# Altium project Pneumatics Control Board.PrjPcb
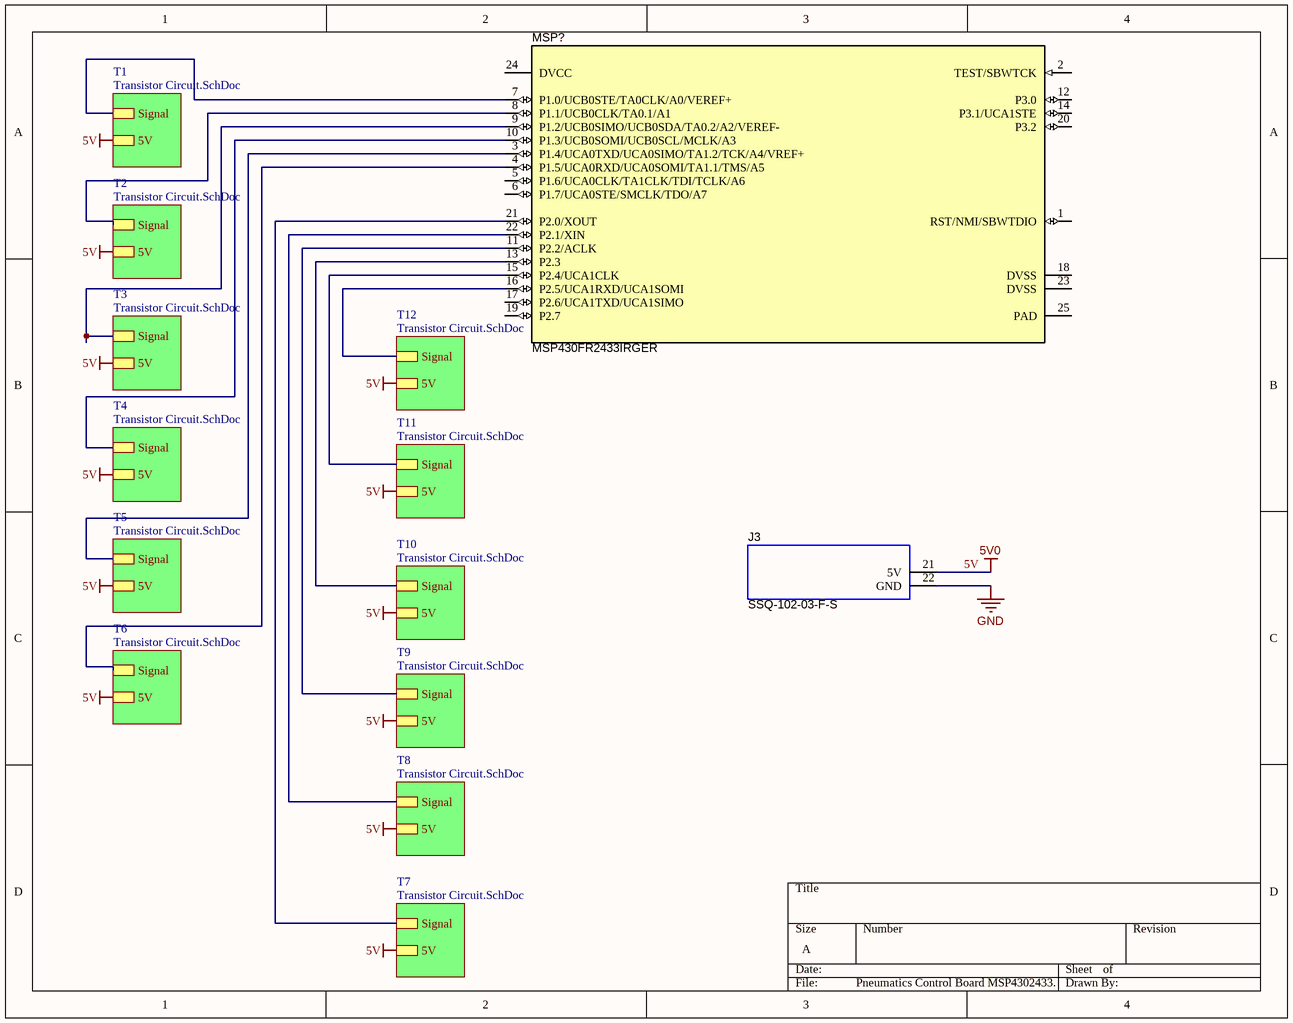
[diagram p0: Pneumatics Control Board MSP4302433.SchDoc]
2 sheets, 50 parts. Net scope: hierarchical (ports join the sheet entries above them; power ports are global).
Board file: Pneumatics Control Board.PcbDoc
Sheets:
  Pneumatics Control Board MSP4302433.SchDoc
    T7 = Transistor Circuit.SchDoc
    T8 = Transistor Circuit.SchDoc
    T9 = Transistor Circuit.SchDoc
    T10 = Transistor Circuit.SchDoc
    T11 = Transistor Circuit.SchDoc
    T12 = Transistor Circuit.SchDoc
    T1 = Transistor Circuit.SchDoc
    T6 = Transistor Circuit.SchDoc
    T5 = Transistor Circuit.SchDoc
    T4 = Transistor Circuit.SchDoc
    T3 = Transistor Circuit.SchDoc
    T2 = Transistor Circuit.SchDoc

## Sheet Pneumatics Control Board MSP4302433.SchDoc
size A; SheetNumber: 1; SheetTotal: 2

### Parts
J3  SSQ-102-03-F-S  [BoosterPack_20pin_J3]
MSP?  MSP430FR2433IRGER  [RGE0024H]

### Sub-sheets
T1 = Transistor Circuit.SchDoc: Signal, 5V
T2 = Transistor Circuit.SchDoc: Signal, 5V
T3 = Transistor Circuit.SchDoc: Signal, 5V
T4 = Transistor Circuit.SchDoc: Signal, 5V
T5 = Transistor Circuit.SchDoc: Signal, 5V
T6 = Transistor Circuit.SchDoc: Signal, 5V
T7 = Transistor Circuit.SchDoc: Signal, 5V
T8 = Transistor Circuit.SchDoc: Signal, 5V
T9 = Transistor Circuit.SchDoc: Signal, 5V
T10 = Transistor Circuit.SchDoc: Signal, 5V
T11 = Transistor Circuit.SchDoc: Signal, 5V
T12 = Transistor Circuit.SchDoc: Signal, 5V

### Nets
5V: J3.21(5V) ; sheet T7/5V, sheet T8/5V, sheet T9/5V, sheet T10/5V, sheet T11/5V, sheet T12/5V, sheet T1/5V, sheet T6/5V, sheet T5/5V, sheet T4/5V, sheet T3/5V, sheet T2/5V  [also labelled 5V0]
GND: J3.22(GND)
NetMSP?_3: MSP?.3(P1.4/UCA0TXD/UCA0SIMO/TA1.2/TCK/A4/VREF+) ; sheet T5/Signal
NetMSP?_4: MSP?.4(P1.5/UCA0RXD/UCA0SOMI/TA1.1/TMS/A5) ; sheet T6/Signal
NetMSP?_7: MSP?.7(P1.0/UCB0STE/TA0CLK/A0/VEREF+) ; sheet T1/Signal
NetMSP?_8: MSP?.8(P1.1/UCB0CLK/TA0.1/A1) ; sheet T2/Signal
NetMSP?_9: MSP?.9(P1.2/UCB0SIMO/UCB0SDA/TA0.2/A2/VEREF-) ; sheet T3/Signal
NetMSP?_10: MSP?.10(P1.3/UCB0SOMI/UCB0SCL/MCLK/A3) ; sheet T4/Signal
NetMSP?_11: MSP?.11(P2.2/ACLK) ; sheet T9/Signal
NetMSP?_13: MSP?.13(P2.3) ; sheet T10/Signal
NetMSP?_15: MSP?.15(P2.4/UCA1CLK) ; sheet T11/Signal
NetMSP?_16: MSP?.16(P2.5/UCA1RXD/UCA1SOMI) ; sheet T12/Signal
NetMSP?_21: MSP?.21(P2.0/XOUT) ; sheet T7/Signal
NetMSP?_22: MSP?.22(P2.1/XIN) ; sheet T8/Signal

Not connected (* = marked no-connect by the designer): MSP? 1(RST/NMI/SBWTDIO) 2(TEST/SBWTCK) 5(P1.6/UCA0CLK/TA1CLK/TDI/TCLK/A6) 6(P1.7/UCA0STE/SMCLK/TDO/A7) 12(P3.0) 14(P3.1/UCA1STE) 17(P2.6/UCA1TXD/UCA1SIMO) 18(DVSS) 19(P2.7) 20(P3.2) 23(DVSS) 24(DVCC) 25(PAD)

### Library data of the parts
J3 = BoosterPack_20pin_J3: Receptacle, 2.54mm, 2x1, Gold, TH; Manufacturer: Samtec; SymbolCreator: a0412235; Note: Booster Pack 20 pin J3; SymbolVersion: 2015-10-21; CompType: Receptacle; PartNumber: SSQ-102-03-F-S; RoHS: Y; PackageReference: 2x1 Receptacle; MountType: TH; ComponentLink1Description: Datasheet Link; Publisher: Texas Instruments; LatestRevisionDate: 2017-03-01; Supplier 1: Farnell; Supplier Part Number 1: 2283777
MSP? = MSP430FR2433IRGER: MSP430FR2433 16 MHz Ultra-Low-Power Microcontroller with 16 KB FRAM, 4 KB RAM, 19 IO, 4 Timers, RGE0024H (VQFN-24); Alternate PartNumber: MSP430FR2433IRGET; Manufacturer: Texas Instruments; SymbolCreator: Altium; SizeArea_mm2: 16; SizeAreaWB_mm2: 25; SizeX_mm: 4; SizeZ_mm: 1; CompType: IC; U/M: EA; Note: TI Provided; SymbolVersion: 2015-09-16; PartNumber: MSP430FR2433IRGER; PackageReference: RGE0024H; PackageDescription: VQFN-24; MountType: SMT; SizeY_mm: 4; ComponentLink1Description: Datasheet Link; ComponentLink1URL: http://www.ti.com/lit/ds/symlink/msp430fr2433.pdf; Publisher: Texas Instruments; LatestRevisionDate: 2017-03-06; Alternate Manufacturer: Texas Instruments

## Sheet Transistor Circuit.SchDoc
size A; DrawnBy: Jonathan Reese; Engineer: Jonathan Reese; Organization: URC; DocumentNumber: 2; Revision: 1; SheetNumber: 2; SheetTotal: 2; DocumentName: Pnuematics Transistor Circuit; ProjectName: Pnuematics Board
Used 12 times, as channels T7, T8, T9, T10, T11, T12, T1, T6, T5, T4, T3, T2. Parts and nets are listed once, with the designators drawn on the sheet.
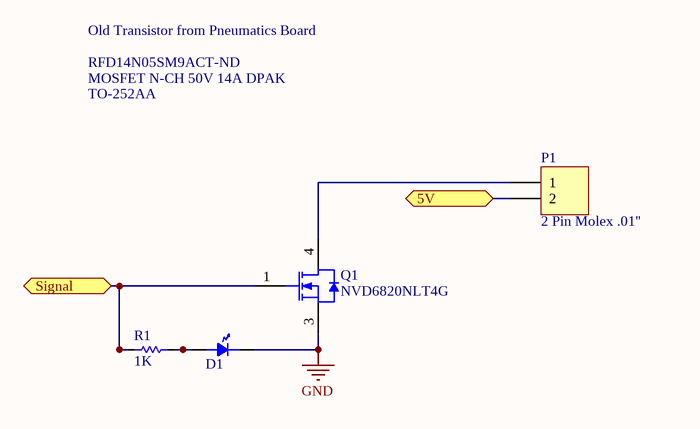
[diagram p1: Transistor Circuit.SchDoc]

### Parts
D1  LED  [LED0805]  (value not drawn)
P1  2 Pin Molex .01''  [HDR1X2]
Q1  NVD6820NLT4G  [ONSC-DPAK-3-369C-01_V]
R1  value 1K  [R0805]  (hidden comment: Resistor)

### Ports
5V, Signal

### Nets
GND: D1.1 Q1.3(S)
5V: P1.2 ; port 5V
Signal: Q1.1(G) R1.1 ; port Signal
NetD1_2: D1.2 R1.2
NetP1_1: P1.1 Q1.4(D)

### Channels
T7: designators end in _T7; ports 5V=5V Signal=NetMSP?_21
T8: designators end in _T8; ports 5V=5V Signal=NetMSP?_22
T9: designators end in _T9; ports 5V=5V Signal=NetMSP?_11
T10: designators end in _T10; ports 5V=5V Signal=NetMSP?_13
T11: designators end in _T11; ports 5V=5V Signal=NetMSP?_15
T12: designators end in _T12; ports 5V=5V Signal=NetMSP?_16
T1: designators end in _T1; ports 5V=5V Signal=NetMSP?_7
T6: designators end in _T6; ports 5V=5V Signal=NetMSP?_4
T5: designators end in _T5; ports 5V=5V Signal=NetMSP?_3
T4: designators end in _T4; ports 5V=5V Signal=NetMSP?_10
T3: designators end in _T3; ports 5V=5V Signal=NetMSP?_9
T2: designators end in _T2; ports 5V=5V Signal=NetMSP?_8

### Notes on the sheet
- RFD14N05SM9ACT-ND
- MOSFET N-CH 50V 14A DPAK
- TO-252AA
- Old Transistor from Pneumatics Board
- Title
- Size:
- Date:
- A
- Number:
- Time:
- Revision:
- Sheet
- of
- File:

### Library data of the parts
P1 = Header 2: Header, 2-Pin; LatestRevisionDate: 17-Jul-2002; LatestRevisionNote: Re-released for DXP Platform.; Publisher: Altium Limited
Q1 = NVD6820NLT4G: Power MOSFET, 90 V, 50 A, 17 mOhm, Single N-Channel, 3-Pin DPAK, Pb-Free, Tape and Reel; Manufacturer: On Semiconductor; Channel Polarity: N Channel; Ciss Typ (pF): 4209; Coss Typ (pF): 253; Crss Typ (pF): 187; ID Max (A): 50; Qrr Typ (nC): 55; V(BR)DSS Min (V): 90; VGS Max (V): 20; VGS(th) Max (V): 2.5; DatasheetVersion: Rev. 1; PackageVersion: Rev. E, 02/2014; PackageReference: DPAK-3-369C-01; PackageDescription: 3-Pin Flange Mount, Body 6.54 x 6.095 mm, Pitch 2.29 mm; Supplier 1: Newark; Supplier Part Number 1: 60W1843; Supplier 2: Mouser; Supplier Part Number 2: 863-NVD6820NLT4G; Configuration: Single; Package Type: DPAK-3; Packing: Tape and Reel; RoHS: Pb-Free; Mounting Technology: Surface Mount; PartNumber: NVD6820NLT4G; ComponentLink1Description: Manufacturer URL; ComponentLink1URL: http://www.onsemi.com/; ComponentLink2Description: Datasheet; ComponentLink2URL: http://www.onsemi.cn/pub_link/Collateral/NVD6820NL-D.PDF; ComponentLink3Description: Package Specification; ComponentLink3URL: http://www.onsemi.cn/pub_link/Collateral/369C.PDF
R1 = Res: Tolerance: 5%

## Nets that join several sheets
5V: Pneumatics Control Board MSP4302433 (J3.21), T7 (P1_T7.2), T8 (P1_T8.2), T9 (P1_T9.2), T10 (P1_T10.2), T11 (P1_T11.2), T12 (P1_T12.2), T1 (P1_T1.2), T6 (P1_T6.2), T5 (P1_T5.2), T4 (P1_T4.2), T3 (P1_T3.2), T2 (P1_T2.2)
GND: Pneumatics Control Board MSP4302433 (J3.22), T7 (D1_T7.1 Q1_T7.3), T8 (D1_T8.1 Q1_T8.3), T9 (D1_T9.1 Q1_T9.3), T10 (D1_T10.1 Q1_T10.3), T11 (D1_T11.1 Q1_T11.3), T12 (D1_T12.1 Q1_T12.3), T1 (D1_T1.1 Q1_T1.3), T6 (D1_T6.1 Q1_T6.3), T5 (D1_T5.1 Q1_T5.3), T4 (D1_T4.1 Q1_T4.3), T3 (D1_T3.1 Q1_T3.3), T2 (D1_T2.1 Q1_T2.3)
NetMSP?_3: Pneumatics Control Board MSP4302433 (MSP?.3), T5 (Q1_T5.1 R1_T5.1)
NetMSP?_4: Pneumatics Control Board MSP4302433 (MSP?.4), T6 (Q1_T6.1 R1_T6.1)
NetMSP?_7: Pneumatics Control Board MSP4302433 (MSP?.7), T1 (Q1_T1.1 R1_T1.1)
NetMSP?_8: Pneumatics Control Board MSP4302433 (MSP?.8), T2 (Q1_T2.1 R1_T2.1)
NetMSP?_9: Pneumatics Control Board MSP4302433 (MSP?.9), T3 (Q1_T3.1 R1_T3.1)
NetMSP?_10: Pneumatics Control Board MSP4302433 (MSP?.10), T4 (Q1_T4.1 R1_T4.1)
NetMSP?_11: Pneumatics Control Board MSP4302433 (MSP?.11), T9 (Q1_T9.1 R1_T9.1)
NetMSP?_13: Pneumatics Control Board MSP4302433 (MSP?.13), T10 (Q1_T10.1 R1_T10.1)
NetMSP?_15: Pneumatics Control Board MSP4302433 (MSP?.15), T11 (Q1_T11.1 R1_T11.1)
NetMSP?_16: Pneumatics Control Board MSP4302433 (MSP?.16), T12 (Q1_T12.1 R1_T12.1)
NetMSP?_21: Pneumatics Control Board MSP4302433 (MSP?.21), T7 (Q1_T7.1 R1_T7.1)
NetMSP?_22: Pneumatics Control Board MSP4302433 (MSP?.22), T8 (Q1_T8.1 R1_T8.1)